# EAGLE design schemat (EAGLE 6.6.0)
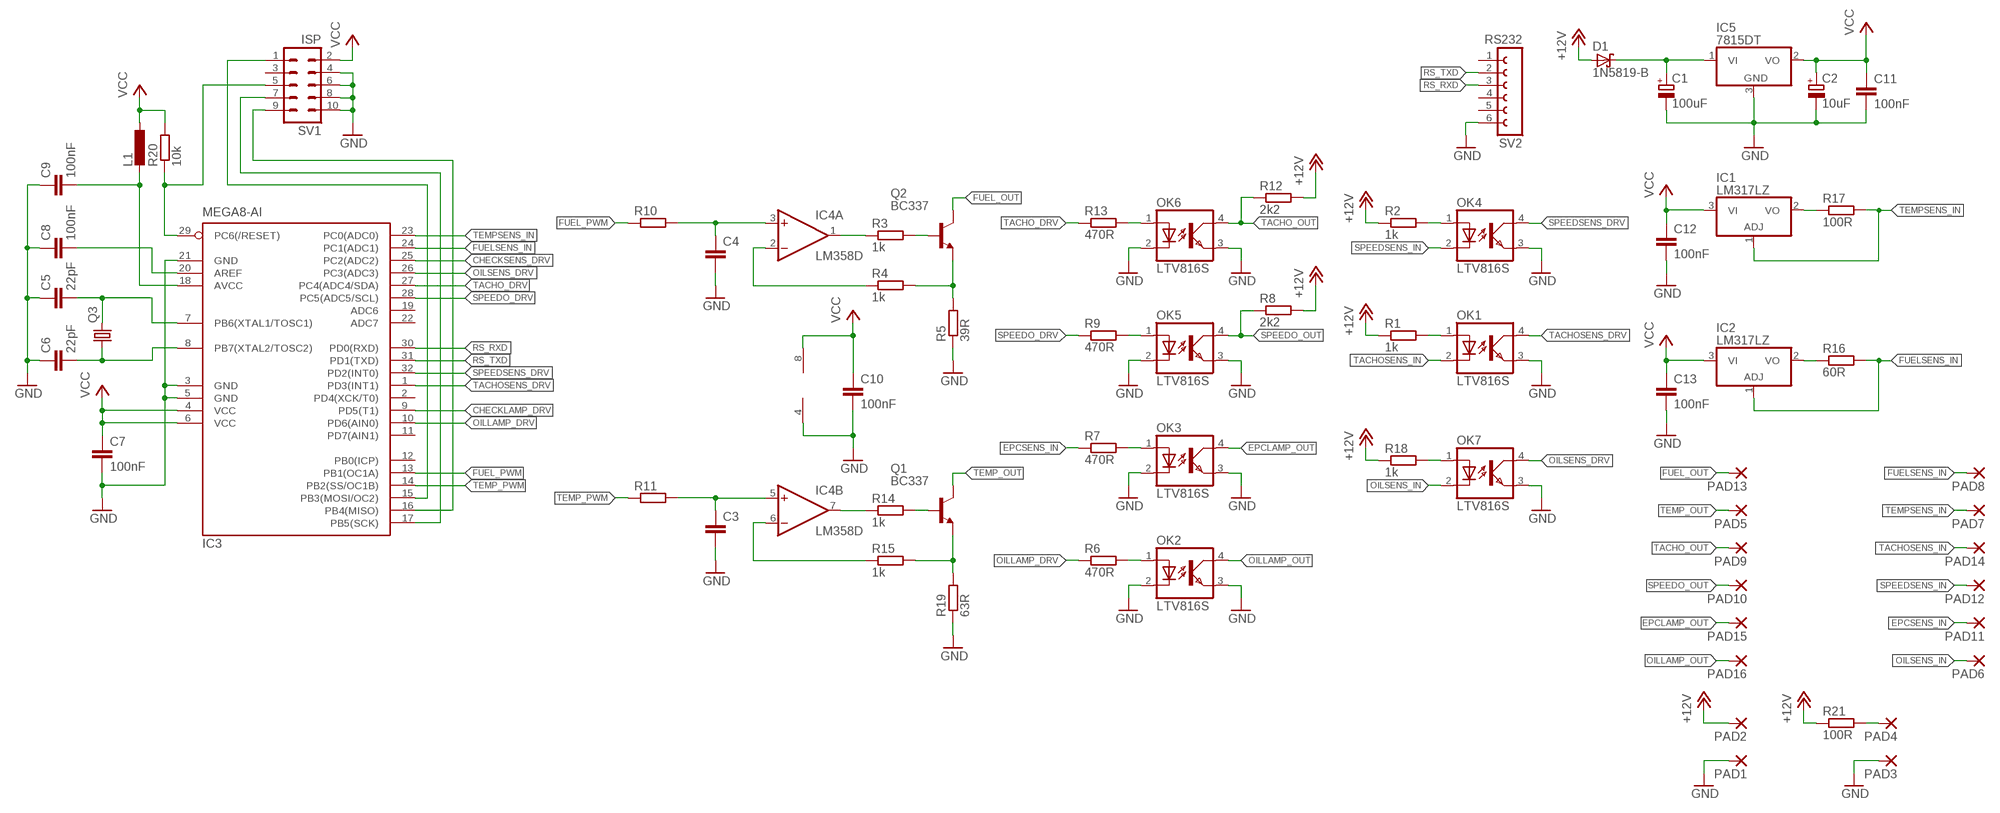
[diagram p0: schematic, sheet 1]

## Parts
C1  100uF  CPOL-EUE2.5-6  [E2,5-6]
C2  10uF  CPOL-EUE2.5-6  [E2,5-6]
C3  C-EU025-025X050  [C025-025X050]
C4  C-EU025-025X050  [C025-025X050]
C5  22pF  C-EUC0805  [C0805]
C6  22pF  C-EUC0805  [C0805]
C7  100nF  C-EUC0805  [C0805]
C8  100nF  C-EUC0805  [C0805]
C9  100nF  C-EUC0805  [C0805]
C10  100nF  C-EUC0805  [C0805]
C11  100nF  C-EUC0805  [C0805]
C12  100nF  C-EUC0805  [C0805]
C13  100nF  C-EUC0805  [C0805]
D1  1N5819-B  [DO41-7.6]
IC1  LM317LZ  [TO92]
IC2  LM317LZ  [TO92]
IC3  MEGA8-AI  [TQFP32-08]
IC4  LM358D  [SO08]
IC5  7815DT  [TO252]
L1  L-EU0207/7  [0207/7]
OK1  LTV816S  [SMD4]
OK2  LTV816S  [SMD4]
OK3  LTV816S  [SMD4]
OK4  LTV816S  [SMD4]
OK5  LTV816S  [SMD4]
OK6  LTV816S  [SMD4]
OK7  LTV816S  [SMD4]
PAD1  2,54/1,1  [2,54/1,1]
PAD2  2,54/1,1  [2,54/1,1]
PAD3  2,54/1,1  [2,54/1,1]
PAD4  2,54/1,1  [2,54/1,1]
PAD5  2,54/1,1  [2,54/1,1]
PAD6  2,54/1,1  [2,54/1,1]
PAD7  2,54/1,1  [2,54/1,1]
PAD8  2,54/1,1  [2,54/1,1]
PAD9  2,54/1,1  [2,54/1,1]
PAD10  2,54/1,1  [2,54/1,1]
PAD11  2,54/1,1  [2,54/1,1]
PAD12  2,54/1,1  [2,54/1,1]
PAD13  2,54/1,1  [2,54/1,1]
PAD14  2,54/1,1  [2,54/1,1]
PAD15  2,54/1,1  [2,54/1,1]
PAD16  2,54/1,1  [2,54/1,1]
Q1  BC337  [TO92]
Q2  BC337  [TO92]
Q3  CRYSTALHC49UP  [HC49UP]
R1  1k  R-EU_M0805  [M0805]
R2  1k  R-EU_M0805  [M0805]
R3  1k  R-EU_M0805  [M0805]
R4  1k  R-EU_M0805  [M0805]
R5  39R  R-EU_M0805  [M0805]
R6  470R  R-EU_M0805  [M0805]
R7  470R  R-EU_M0805  [M0805]
R8  2k2  R-EU_M0805  [M0805]
R9  470R  R-EU_M0805  [M0805]
R10  R-EU_M0805  [M0805]
R11  R-EU_M0805  [M0805]
R12  2k2  R-EU_M0805  [M0805]
R13  470R  R-EU_M0805  [M0805]
R14  1k  R-EU_M0805  [M0805]
R15  1k  R-EU_M0805  [M0805]
R16  60R  R-EU_M0805  [M0805]
R17  100R  R-EU_M0805  [M0805]
R18  1k  R-EU_M0805  [M0805]
R19  63R  R-EU_M0805  [M0805]
R20  10k  R-EU_M0805  [M0805]
R21  100R  R-EU_M0805  [M0805]
SV1  ISP  ML10L  [ML10L]
SV2  RS232  FE06-1  [FE06]

## Nets
+12V: D1.A PAD2.1(P) R1.1 R2.1 R8.2 R12.2 R18.1 R21.1
CHECKLAMP_DRV: IC3.9(PD5(T1))
CHECKSENS_DRV: IC3.25(PC2(ADC2))
EPCLAMP_OUT: OK3.4(COL) PAD15.1(P)
EPCSENS_IN: PAD11.1(P) R7.1
FUEL_OUT: PAD13.1(P) Q2.3(C)
FUEL_PWM: IC3.13(PB1(OC1A)) R10.1
FUELSENS_IN: IC2.1(ADJ) IC3.24(PC1(ADC1)) PAD8.1(P) R16.2
GND: C1.- C2.- C3.2 C4.2 C5.1 C6.1 C7.2 C8.1 C9.1 C10.2 C11.2 C12.2 C13.2 IC3.3(GND) IC3.5(GND) IC3.21(GND) IC4.4(P:V-) IC5.3(GND) OK1.3(EMIT) OK2.2(C) OK2.3(EMIT) OK3.2(C) OK3.3(EMIT) OK4.3(EMIT) OK5.2(C) OK5.3(EMIT) OK6.2(C) OK6.3(EMIT) OK7.3(EMIT) PAD1.1(P) PAD3.1(P) R5.1 R19.1 SV1.4 SV1.6 SV1.8 SV1.10 SV2.6
N$1: PAD4.1(P) R21.2
N$2: Q2.2(B) R3.2
N$4: IC4.1(A:OUT) R3.1
N$5: Q2.1(E) R4.2 R5.2
N$6: IC4.2(A:-IN) R4.1
N$7: C4.1 IC4.3(A:+IN) R10.2
N$8: Q1.2(B) R14.2
N$9: IC4.7(B:OUT) R14.1
N$10: Q1.1(E) R15.2 R19.2
N$11: IC4.6(B:-IN) R15.1
N$12: C3.1 IC4.5(B:+IN) R11.2
N$13: OK2.1(A) R6.2
N$14: OK6.1(A) R13.2
N$16: OK5.1(A) R9.2
N$17: OK3.1(A) R7.2
N$18: OK1.1(A) R1.2
N$19: OK7.1(A) R18.2
N$20: IC1.2(VO) R17.1
N$21: OK4.1(A) R2.2
N$23: C1.+ D1.C IC5.1(VI)
N$24: IC2.2(VO) R16.1
N$25: C6.2 IC3.8(PB7(XTAL2/TOSC2)) Q3.1
N$26: C5.2 IC3.7(PB6(XTAL1/TOSC1)) Q3.2
N$29: C8.2 IC3.20(AREF)
N$31: C9.2 IC3.18(AVCC) L1.2
N$33: IC3.29(PC6(/RESET)) R20.1 SV1.5
N$37: IC3.15(PB3(MOSI/OC2)) SV1.1
N$38: IC3.17(PB5(SCK)) SV1.7
N$39: IC3.16(PB4(MISO)) SV1.9
OILLAMP_DRV: IC3.10(PD6(AIN0)) R6.1
OILLAMP_OUT: OK2.4(COL) PAD16.1(P)
OILSENS_DRV: IC3.26(PC3(ADC3)) OK7.4(COL)
OILSENS_IN: OK7.2(C) PAD6.1(P)
RS_RXD: IC3.30(PD0(RXD)) SV2.3
RS_TXD: IC3.31(PD1(TXD)) SV2.2
SPEEDO_DRV: IC3.28(PC5(ADC5/SCL)) R9.1
SPEEDO_OUT: OK5.4(COL) PAD10.1(P) R8.1
SPEEDSENS_DRV: IC3.32(PD2(INT0)) OK4.4(COL)
SPEEDSENS_IN: OK4.2(C) PAD12.1(P)
TACHO_DRV: IC3.27(PC4(ADC4/SDA)) R13.1
TACHO_OUT: OK6.4(COL) PAD9.1(P) R12.1
TACHOSENS_DRV: IC3.1(PD3(INT1)) OK1.4(COL)
TACHOSENS_IN: OK1.2(C) PAD14.1(P)
TEMP_OUT: PAD5.1(P) Q1.3(C)
TEMP_PWM: IC3.14(PB2(SS/OC1B)) R11.1
TEMPSENS_IN: IC1.1(ADJ) IC3.23(PC0(ADC0)) PAD7.1(P) R17.2
VCC: C2.+ C7.1 C10.1 C11.1 C12.1 C13.1 IC1.3(VI) IC2.3(VI) IC3.4(VCC) IC3.6(VCC) IC4.8(P:V+) IC5.2(VO) L1.1 R20.2 SV1.2
Unconnected: IC3.2(PD4(XCK/T0)) IC3.11(PD7(AIN1)) IC3.12(PB0(ICP)) IC3.19(ADC6) IC3.22(ADC7) SV1.3 SV2.1 SV2.4 SV2.5

## Library data of the parts
C1 C2 = rcl:CPOL-EU: POLARIZED CAPACITOR, European symbol
C3-C13 = rcl:C-EU: CAPACITOR, European symbol
D1 = diode:1N581*: 1.0A SCHOTTKY BARRIER RECTIFIER Source: http://www.diodes.com/datasheets/ds23001.pdf
IC1 IC2 = linear:*317: Positive VOLTAGE REGULATOR
IC3 = atmel:MEGA8: MICROCONTROLLER 8 Kbytes FLASH, 1 kbytes SRAM, 512 bytes EEPROM, USART, 6-channel 10 bit ADC, 2-channel 8 bit ADC Pin compatible with Atmega48, ATMega88, ATMega168 Source: avr.lbr; MPN: ATMEGA8-16AU; OC_FARNELL: 9171371; OC_NEWARK: 73M8863
IC4 = linear:LM358: OP AMP also LM158; LM258; LM2904 Source: http://cache.national.com/ds/LM/LM158.pdf
IC5 = linear:78*: Positive VOLTAGE REGULATOR Source: http://cache.national.com/ds/LM/LM78L05.pdf http://www.fairchildsemi.com/ds/LM/LM7805.pdf
L1 = rcl:L-EU: INDUCTOR, European symbol
OK1-OK7 = optocoupler:LTV816: OPTO COUPLER Source: LITEON, LTV816.pdf; OC_FARNELL: unknown; OC_NEWARK: unknown
PAD1-PAD16 = wirepad:2,54/1,1: THROUGH-HOLE PAD
Q1 Q2 = transistor-npn:BC337*: NPN Transistor
Q3 = crystal:CRYSTAL: CRYSTAL; OC_FARNELL: unknown; OC_NEWARK: unknown
R1-R21 = rcl:R-EU_: RESISTOR, European symbol
SV1 = con-ml:ML10L: HARTING; OC_FARNELL: unknown; OC_NEWARK: unknown
SV2 = con-lsta:FE06-1: FEMALE HEADER; OC_FARNELL: unknown; OC_NEWARK: unknown

## Board
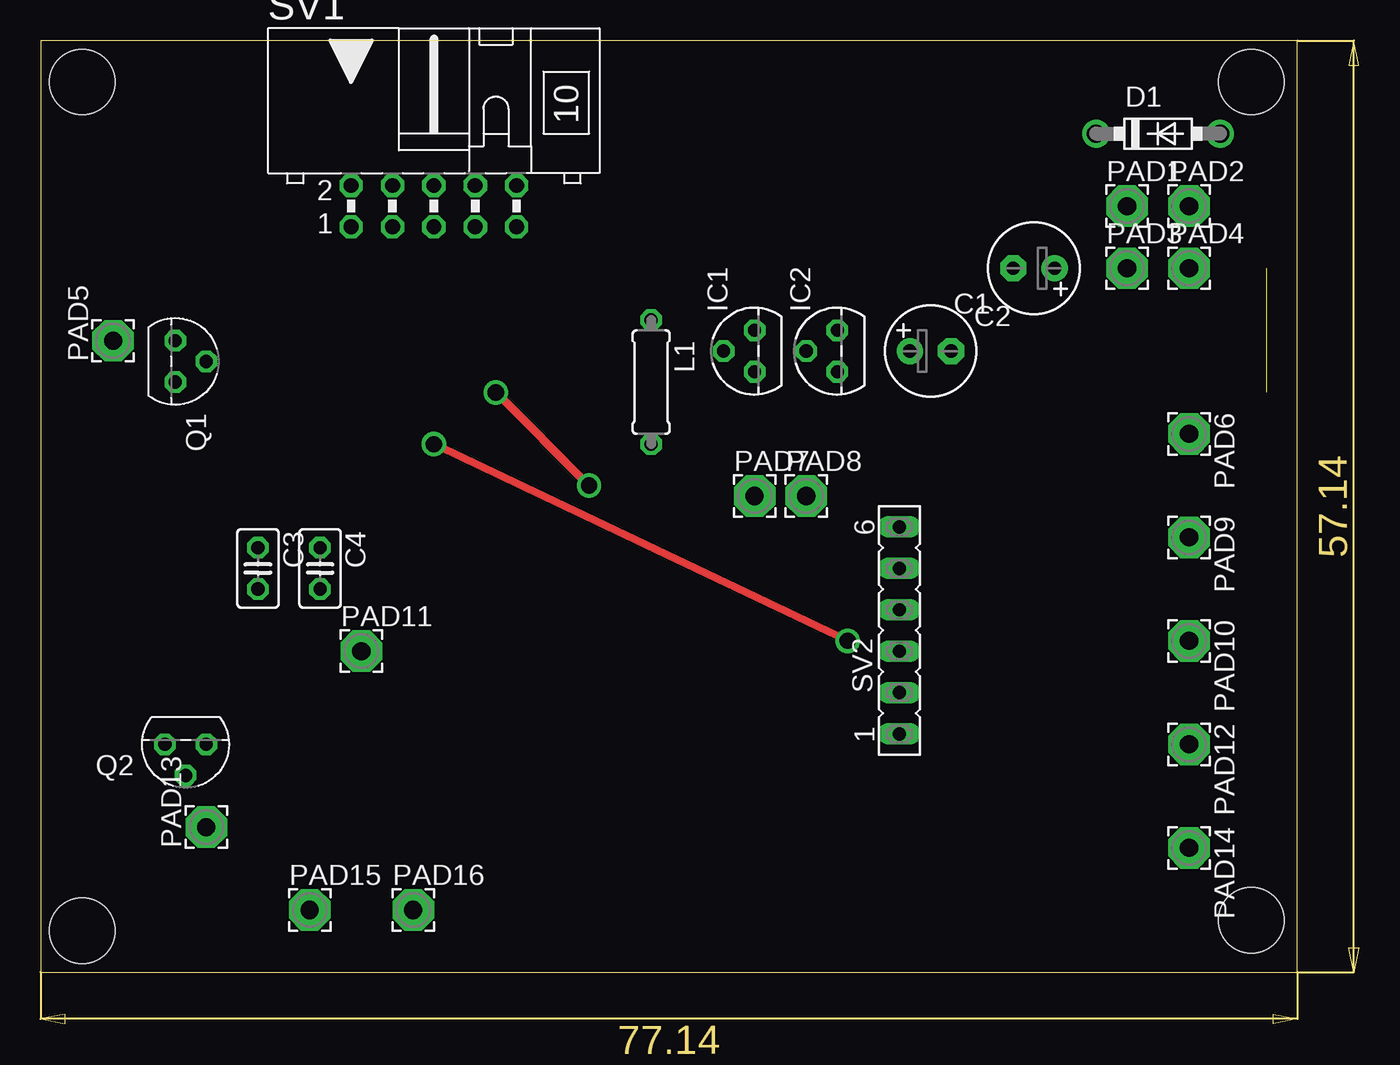
[diagram p1: board, top side]
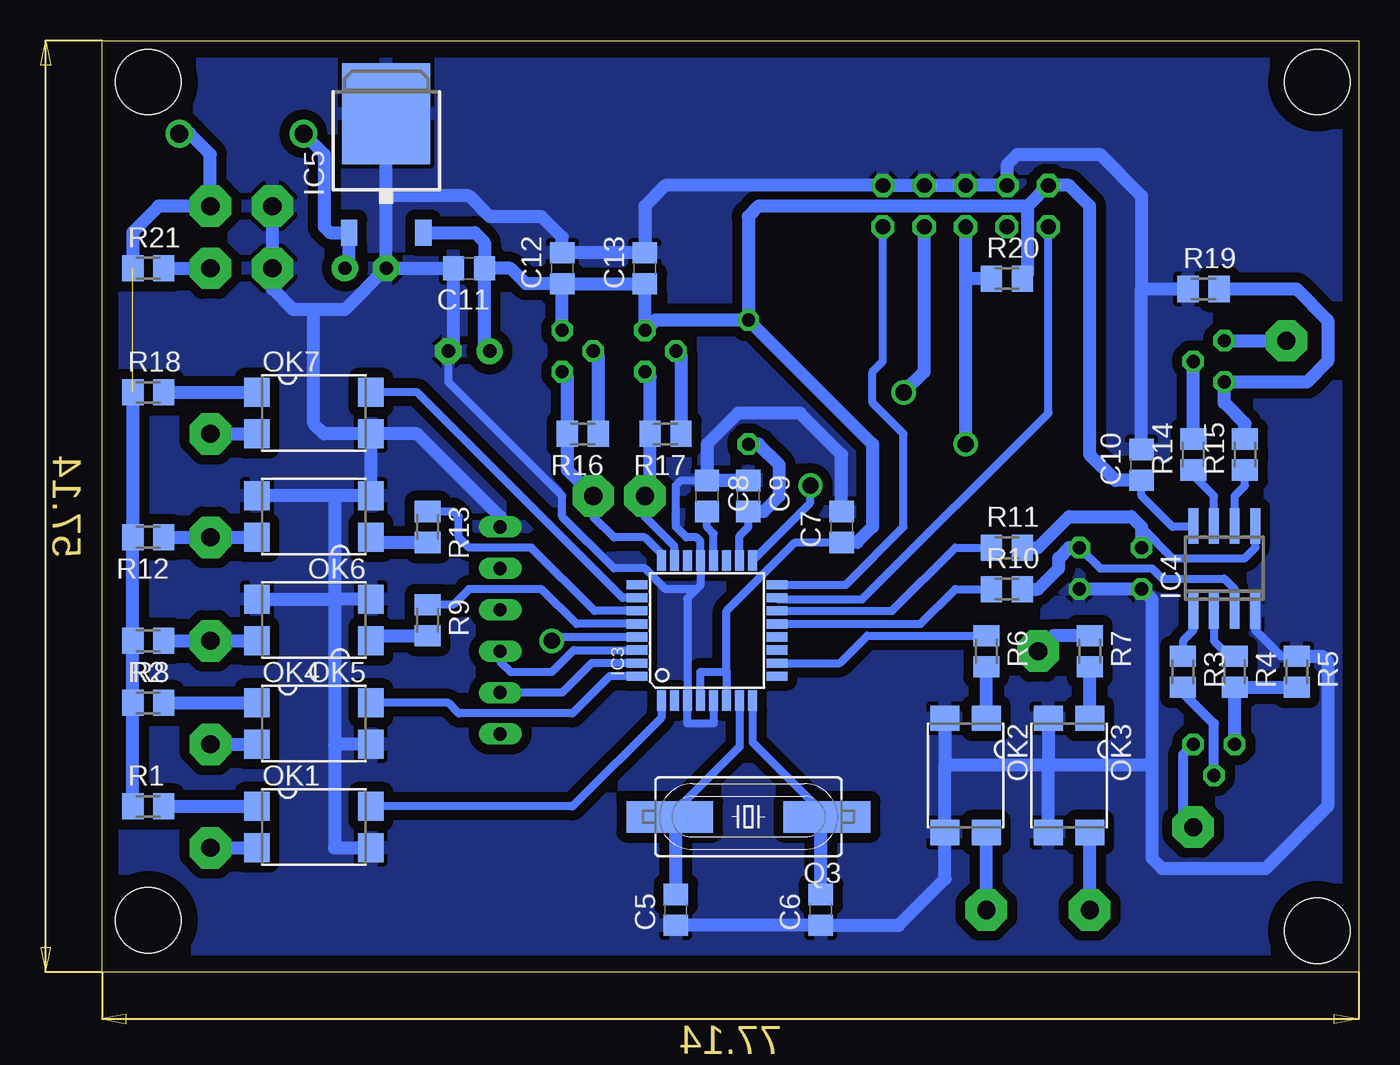
[diagram p2: board, bottom side, seen from below]

Size 77.14 x 57.14 mm. Coordinates in mm from the lower left corner, seen from the top.
Outline: 0,0 77.14,0 77.14,57.14 0,57.14 0,0
Copper layers (1*16): Top 0.035mm / dielectric 1.5mm / Bottom 0.035mm
Design rules "default": minimum track width 10mil, minimum drill 24mil, track to track 8mil, track to pad 8mil, pad to pad 8mil, via to via 8mil, smd to smd 8mil, copper to edge 40mil, drill to drill 8mil, minimum pad ring 10mil, minimum via ring 8mil, stop-mask expansion 4mil, vias tented up to drill 0mil, thermal gap 10mil
Holes 4 mm at 74.3,54.61 2.54,2.54 2.54,54.61 74.3,3.17

### Footprints (pad centres in the part's own frame; a part is rotated, then mirrored left to right if it is on the bottom)
E2,5-6 = drill 0.813 pad 1.6: + -1.27,0 | drill 0.813 pad 1.6 octagon: - 1.27,0
C025-025X050 = drill 0.813 octagon: 1 -1.27,0; 2 1.27,0
C0805 = smd 1.3 x 1.5: 1 -0.95,0; 2 0.95,0
DO41-7.6 = drill 1.1 pad 1.7: A 3.81,0; C -3.81,0
TO92 = drill 0.813 octagon: 1 -1.27,0; 2 0,1.905; 3 1.27,0
TQFP32-08 = smd 1.27 x 0.559: 1 -4.293,2.8; 2 -4.293,2; 3 -4.293,1.2; 4 -4.293,0.4; 5 -4.293,-0.4; 6 -4.293,-1.2; 7 -4.293,-2; 8 -4.293,-2.8; 17 4.293,-2.8; 18 4.293,-2; 19 4.293,-1.2; 20 4.293,-0.4; 21 4.293,0.4; 22 4.293,1.2; 23 4.293,2; 24 4.293,2.8 | smd 0.559 x 1.27: 9 -2.8,-4.293; 10 -2,-4.293; 11 -1.2,-4.293; 12 -0.4,-4.293; 13 0.4,-4.293; 14 1.2,-4.293; 15 2,-4.293; 16 2.8,-4.293; 25 2.8,4.293; 26 2,4.293; 27 1.2,4.293; 28 0.4,4.293; 29 -0.4,4.293; 30 -1.2,4.293; 31 -2,4.293; 32 -2.8,4.293
SO08 = smd 0.6 x 2.2: 1 -1.905,-2.6; 2 -0.635,-2.6; 3 0.635,-2.6; 4 1.905,-2.6; 5 1.905,2.6; 6 0.635,2.6; 7 -0.635,2.6; 8 -1.905,2.6
TO252 = smd 1 x 1.6: 1 -2.28,-4.8; 2 2.28,-4.8 | smd 5.4 x 6.2: 3 0,2.5
0207/7 = drill 0.813 octagon: 1 -3.81,0; 2 3.81,0
SMD4 = smd 1.78 x 1.55: 1 -1.27,-3.5; 2 1.27,-3.5; 3 1.27,3.5; 4 -1.27,3.5
2,54/1,1 = drill 1.118 pad 2.54 octagon: 1 0,0
TO92' = drill 0.813 octagon: 1 1.27,0; 2 0,1.905; 3 -1.27,0
HC49UP = smd 5.334 x 1.93: 1 -4.826,0; 2 4.826,0
M0805 = smd 1.3 x 1.6: 1 -0.95,0; 2 0.95,0
ML10L = drill 0.914 octagon: 1 -5.08,-1.27; 2 -5.08,1.27; 3 -2.54,-1.27; 4 -2.54,1.27; 5 0,-1.27; 6 0,1.27; 7 2.54,-1.27; 8 2.54,1.27; 9 5.08,-1.27; 10 5.08,1.27
FE06 = drill 0.813 long: 1 -6.35,0; 2 -3.81,0; 3 -1.27,0; 4 1.27,0; 5 3.81,0; 6 6.35,0

### Placement (x,y rotation side)
C1  60.96,43.18 180 top
C2  54.61,38.1 0 top
C3  13.34,24.76 270 top
C4  17.14,24.76 270 top
C5  41.91,3.81 90 bottom
C6  33.02,3.81 90 bottom
C7  31.75,27.3 90 bottom
C8  40.01,29.21 270 bottom
C9  37.47,29.21 270 bottom
C10  13.34,31.11 90 bottom
C11  54.61,43.18 180 bottom
C12  48.9,43.18 90 bottom
C13  43.81,43.18 90 bottom
D1  68.58,51.44 0 top
IC1  43.81,38.1 90 top
IC2  48.9,38.1 90 top
IC3  40.01,20.95 90 bottom
IC4  8.26,24.76 0 bottom
IC5  59.69,50.16 0 bottom
L1  37.47,36.2 270 top
OK1  64.14,8.89 270 bottom
OK2  24.13,12.06 180 bottom
OK3  17.78,12.06 180 bottom
OK4  64.14,15.24 270 bottom
OK5  64.14,21.59 90 bottom
OK6  64.14,27.94 90 bottom
OK7  64.14,34.29 270 bottom
PAD1  66.67,46.99 0 top
PAD2  70.48,46.99 0 top
PAD3  66.67,43.18 0 top
PAD4  70.48,43.18 0 top
PAD5  4.45,38.73 90 top
PAD6  70.48,33.02 270 top
PAD7  43.81,29.21 0 top
PAD8  46.99,29.21 0 top
PAD9  70.48,26.67 270 top
PAD10  70.48,20.32 270 top
PAD11  19.68,19.68 0 top
PAD12  70.48,13.97 270 top
PAD13  10.16,8.89 90 top
PAD14  70.48,7.62 270 top
PAD15  16.51,3.81 0 top
PAD16  22.86,3.81 0 top
Q1  BC337  [TO92']  8.26,37.47 270 top
Q2  BC337  [TO92']  8.89,13.97 180 top
Q3  37.47,9.53 180 bottom
R1  74.3,10.16 0 bottom
R2  74.3,16.51 0 bottom
R3  10.79,18.41 270 bottom
R4  7.62,18.41 270 bottom
R5  3.81,18.41 270 bottom
R6  22.86,19.68 270 bottom
R7  16.51,19.68 270 bottom
R8  74.3,20.32 180 bottom
R9  57.15,21.59 270 bottom
R10  21.59,23.49 0 bottom
R11  21.59,26.04 0 bottom
R12  74.3,26.67 180 bottom
R13  57.15,27.3 270 bottom
R14  10.16,31.75 90 bottom
R15  6.99,31.75 90 bottom
R16  47.62,33.02 180 bottom
R17  42.55,33.02 180 bottom
R18  74.3,35.56 0 bottom
R19  9.53,41.91 0 bottom
R20  21.59,42.55 0 bottom
R21  74.3,43.18 0 bottom
SV1  24.13,46.99 0 top
SV2  52.7,20.95 90 top

### Tracks (layer width: path | path; a pad name or v marks a point on that pad's centre or on a via)
+12V  (1 unrouted)
  Bottom 0.813: R18.1 R12.2 R8.2 R2.1 R1.1 | R21.1 75.25,45.41 73.66,46.99 PAD2.1 70.48,50.16 71.75,51.44 D1.A
EPCLAMP_OUT
  Bottom 0.813: PAD15.1 OK3.4
EPCSENS_IN
  Bottom 0.813: R7.1 18.73,20.63 PAD11.1
FUEL_OUT
  Bottom 0.61: Q2.3 10.79,13.34 10.79,9.53 PAD13.1
FUEL_PWM
  Bottom 0.5: IC3.13 26.91,21.35 24.77,23.49 R10.1
FUELSENS_IN
  Bottom 0.5: IC3.24 42.8,25.66 43.81,26.67 45.72,26.67 46.99,27.94 PAD8.1
  Bottom 0.813: IC2.1 48.58,36.51 R16.2 48.58,30.79 PAD8.1
GND
  Bottom 0.5: C8.1 41.59,30.16 41.91,29.84 41.91,27.3 41.27,26.67 40.64,26.67 40.41,26.43 IC3.21 40.41,23.73 40.64,23.49 | 40.64,23.49 42.55,23.49 43.81,24.76 45.72,24.76 48.9,27.94 48.9,29.21 55.88,36.2 C2.- | 40.64,23.49 41.2,22.93 IC3.3 41.2,15.24 39.6,15.24 IC3.5 | R5.1 4.76,19.36 6.35,20.95 IC4.4
  Bottom 0.813: PAD1.1 PAD3.1 66.67,41.91 65.41,40.64 64.14,40.64 | C2.- 55.56,38.42 C11.2 C1.- | C1.- 59.69,47.62 | 59.69,47.62 IC5.3 | C1.- 62.23,40.64 64.14,40.64 | OK6.2 OK7.3 | OK6.2 OK6.3 | OK6.2 62.87,29.21 62.87,22.86 | 62.87,22.86 62.87,13.97 | 62.87,13.97 62.87,7.62 OK1.3 60.32,7.31 | OK4.3 62.87,13.97 | OK5.2 62.87,22.86 | OK5.3 62.87,22.86 | OK3.2 19.05,12.7 | 19.05,12.7 25.4,12.7 | 25.4,12.7 OK2.3 25.4,5.71 28.25,2.86 C6.1 C5.1 | OK2.2 25.4,12.7 | OK3.3 19.05,12.7 | C7.2 31.75,31.75 34.29,34.29 38.1,34.29 40.01,32.39 C8.1 C9.1 | 12.7,12.7 19.05,12.7 | C4.2 C3.2 12.7,22.86 12.7,12.7 | C10.2 13.34,41.91 | 13.34,41.91 R19.1 | R5.1 2.22,19.36 1.91,19.05 1.91,10.16 5.71,6.35 12.06,6.35 12.7,6.99 12.7,12.7 | 59.69,47.62 54.61,47.62 53.34,46.36 50.16,46.36 48.9,45.09 C12.2 C13.2 43.81,46.99 42.55,48.26 SV1.10 SV1.8 SV1.6 SV1.4 21.59,49.53 20.95,50.16 15.88,50.16 13.34,47.62 13.34,41.91 | OK7.3 63.5,33.02 64.14,33.66 64.14,40.64 | SV2.6 52.7,27.94 57.78,33.02 OK7.3
  pour Bottom (isolate 0.61): 0,57.15 77.47,57.15 77.47,0.64 0,0.64
N$1
  Bottom 0.813: R21.2 PAD4.1
N$2
  Bottom 0.61: Q2.2 8.89,15.24 10.79,17.14 R3.2
N$4
  Bottom 0.5: IC4.1 10.16,20.95 10.79,20.32 R3.1
N$5
  Bottom 0.813: Q2.1 R4.2 R5.2
N$6
  Bottom 0.5: IC4.2 8.89,20.32 7.93,19.36 R4.1
N$7
  Bottom 0.5: C4.1 15.88,24.76 12.7,24.76 12.06,24.13 8.26,24.13 7.62,23.49 IC4.3
  Bottom 0.813: R10.2 19.68,23.49 18.41,24.76 18.41,25.4 17.78,26.04 C4.1
N$8
  Bottom 0.813: R14.2 Q1.2
N$9
  Bottom 0.5: IC4.7 8.89,29.21 10.16,30.48 R14.1
N$10
  Bottom 0.813: R19.2 3.81,41.91 1.91,40.01 1.91,37.47 3.17,36.2 Q1.1 8.26,34.93 6.99,33.66 R15.2
N$11
  Bottom 0.5: IC4.6 7.62,29.21 6.99,29.84 R15.1
N$12
  Bottom 0.5: 13.34,27.3 11.43,25.4 6.99,25.4 6.35,26.04 IC4.5
  Bottom 0.813: R11.2 19.68,26.04 17.78,27.94 13.97,27.94 13.34,27.3 C3.1
N$13
  Bottom 0.813: OK2.1 R6.2
N$14
  Bottom 0.813: OK6.1 60.32,26.35 R13.2
N$16
  Bottom 0.813: OK5.1 60.31,20.64 R9.2
N$17
  Bottom 0.813: OK3.1 R7.2
N$18
  Bottom 0.813: R1.2 OK1.1
N$19
  Bottom 0.813: R18.2 OK7.1
N$20
  Bottom 0.813: IC1.2 41.59,37.79 R17.1
N$21
  Bottom 0.813: R2.2 OK4.1
N$23
  Bottom 0.813: C1.+ 61.97,43.44 IC5.1 63.15,45.37 63.5,45.72 63.5,50.16 D1.C
N$24
  Bottom 0.813: R16.1 46.67,37.79 IC2.2
N$25
  Bottom 0.5: IC3.8 37.2,14.09 Q3.1
  Bottom 0.813: C6.2 33.02,9.14 Q3.1
N$26
  Bottom 0.5: IC3.7 38.01,13.81 Q3.2
  Bottom 0.813: C5.2 41.91,9.14 Q3.2
N$29
  Bottom 0.5: IC3.20 39.6,26.9 40.01,27.3 C8.2
N$31
  Bottom 0.5: IC3.18 38.01,26.76 37.47,27.3 C9.2
  Bottom 0.813: C9.2 36.51,28.26 35.56,29.21 35.56,31.11 36.83,32.39 L1.2
N$33  (via drill 1 pad 1.02)
  Top 0.5: v49.53,20.32 v24.13,32.39
  Bottom 0.5: IC3.29 49.3,20.55 v49.53,20.32
  Bottom 0.813: SV1.5 24.13,42.55 | 24.13,42.55 v24.13,32.39 | R20.1 24.13,42.55
N$37
  Bottom 0.5: IC3.15 35.62,22.86 30.48,22.86 19.05,34.29 SV1.1
N$38  (via drill 1 pad 1.02)
  Top 0.5: v33.66,29.84 v27.94,35.56
  Bottom 0.5: IC3.17 33.66,28.8 v33.66,29.84
  Bottom 0.813: v27.94,35.56 26.67,36.83 SV1.7
N$39
  Bottom 0.5: IC3.16 31.49,23.75 27.94,27.3 27.94,33.02 29.84,34.93 29.84,36.83 29.21,37.47 SV1.9
OILLAMP_DRV
  Bottom 0.5: IC3.10 31.84,18.95 30.16,20.63 R6.1
OILLAMP_OUT
  Bottom 0.813: PAD16.1 OK2.4
OILSENS_DRV
  Bottom 0.5: IC3.26 45.18,22.95 57.78,35.56 OK7.4
OILSENS_IN
  Bottom 0.813: PAD6.1 OK7.2
RS_RXD
  Bottom 0.5: 52.63,19.75 SV2.3 52.7,19.05 52.07,18.41 49.53,18.41 48.19,19.75 IC3.30
RS_TXD
  Bottom 0.5: IC3.31 47.09,18.95 48.9,17.14 SV2.2
SPEEDO_DRV
  Bottom 0.5: IC3.28 48.02,21.35 50.16,23.49 54.61,23.49 55.56,22.54 R9.1
SPEEDO_OUT
  Bottom 0.813: OK5.4 PAD10.1 R8.1
SPEEDSENS_DRV
  Bottom 0.5: IC3.32 45.98,18.15 48.26,15.88 55.24,15.88 55.88,16.51 OK4.4
SPEEDSENS_IN
  Bottom 0.813: PAD12.1 OK4.2
TACHO_DRV
  Bottom 0.5: IC3.27 46.92,22.15 50.8,26.04 54.61,26.04 55.24,26.67 55.24,27.94 55.56,28.25 R13.1
TACHO_OUT
  Bottom 0.813: OK6.4 PAD9.1 R12.1
TACHOSENS_DRV
  Bottom 0.5: IC3.1 42.8,15.62 48.26,10.16 OK1.4
TACHOSENS_IN
  Bottom 0.813: PAD14.1 OK1.2
TEMP_OUT
  Bottom 0.813: Q1.3 PAD5.1
TEMP_PWM
  Bottom 0.5: IC3.14 28.64,22.15 24.77,26.04 R11.1
TEMPSENS_IN
  Bottom 0.5: IC3.23 42.01,26.13 43.81,27.94 PAD7.1
  Bottom 0.813: IC1.1 43.49,36.51 R17.2 43.49,29.53 PAD7.1
VCC
  Bottom 0.5: IC3.4 40.41,18.41 38.8,18.41 | 38.8,18.41 IC3.6 | 38.8,18.41 38.8,22.15 34.6,26.35 C7.1 | IC4.8 10.22,27.3 11.43,27.3 13.34,29.21 C10.1
  Bottom 0.813: C12.1 C13.1 IC1.3 43.18,40.01 L1.1 | IC2.3 C12.1 | C12.1 51.12,42.23 52.07,43.18 C11.1 | C2.+ 53.66,38.42 C11.1 | L1.1 29.84,32.39 29.84,27.3 30.8,26.35 C7.1 | 20.32,46.99 SV1.2 17.78,48.26 16.51,46.99 16.51,31.75 14.93,30.16 C10.1 | 20.32,46.99 36.83,46.99 37.47,46.36 L1.1 | R20.2 20.32,42.87 20.32,46.99 | IC5.2 54.26,45.37 53.66,44.77 C11.1